# EAGLE design esp-stack-mini (EAGLE 7.3.0)
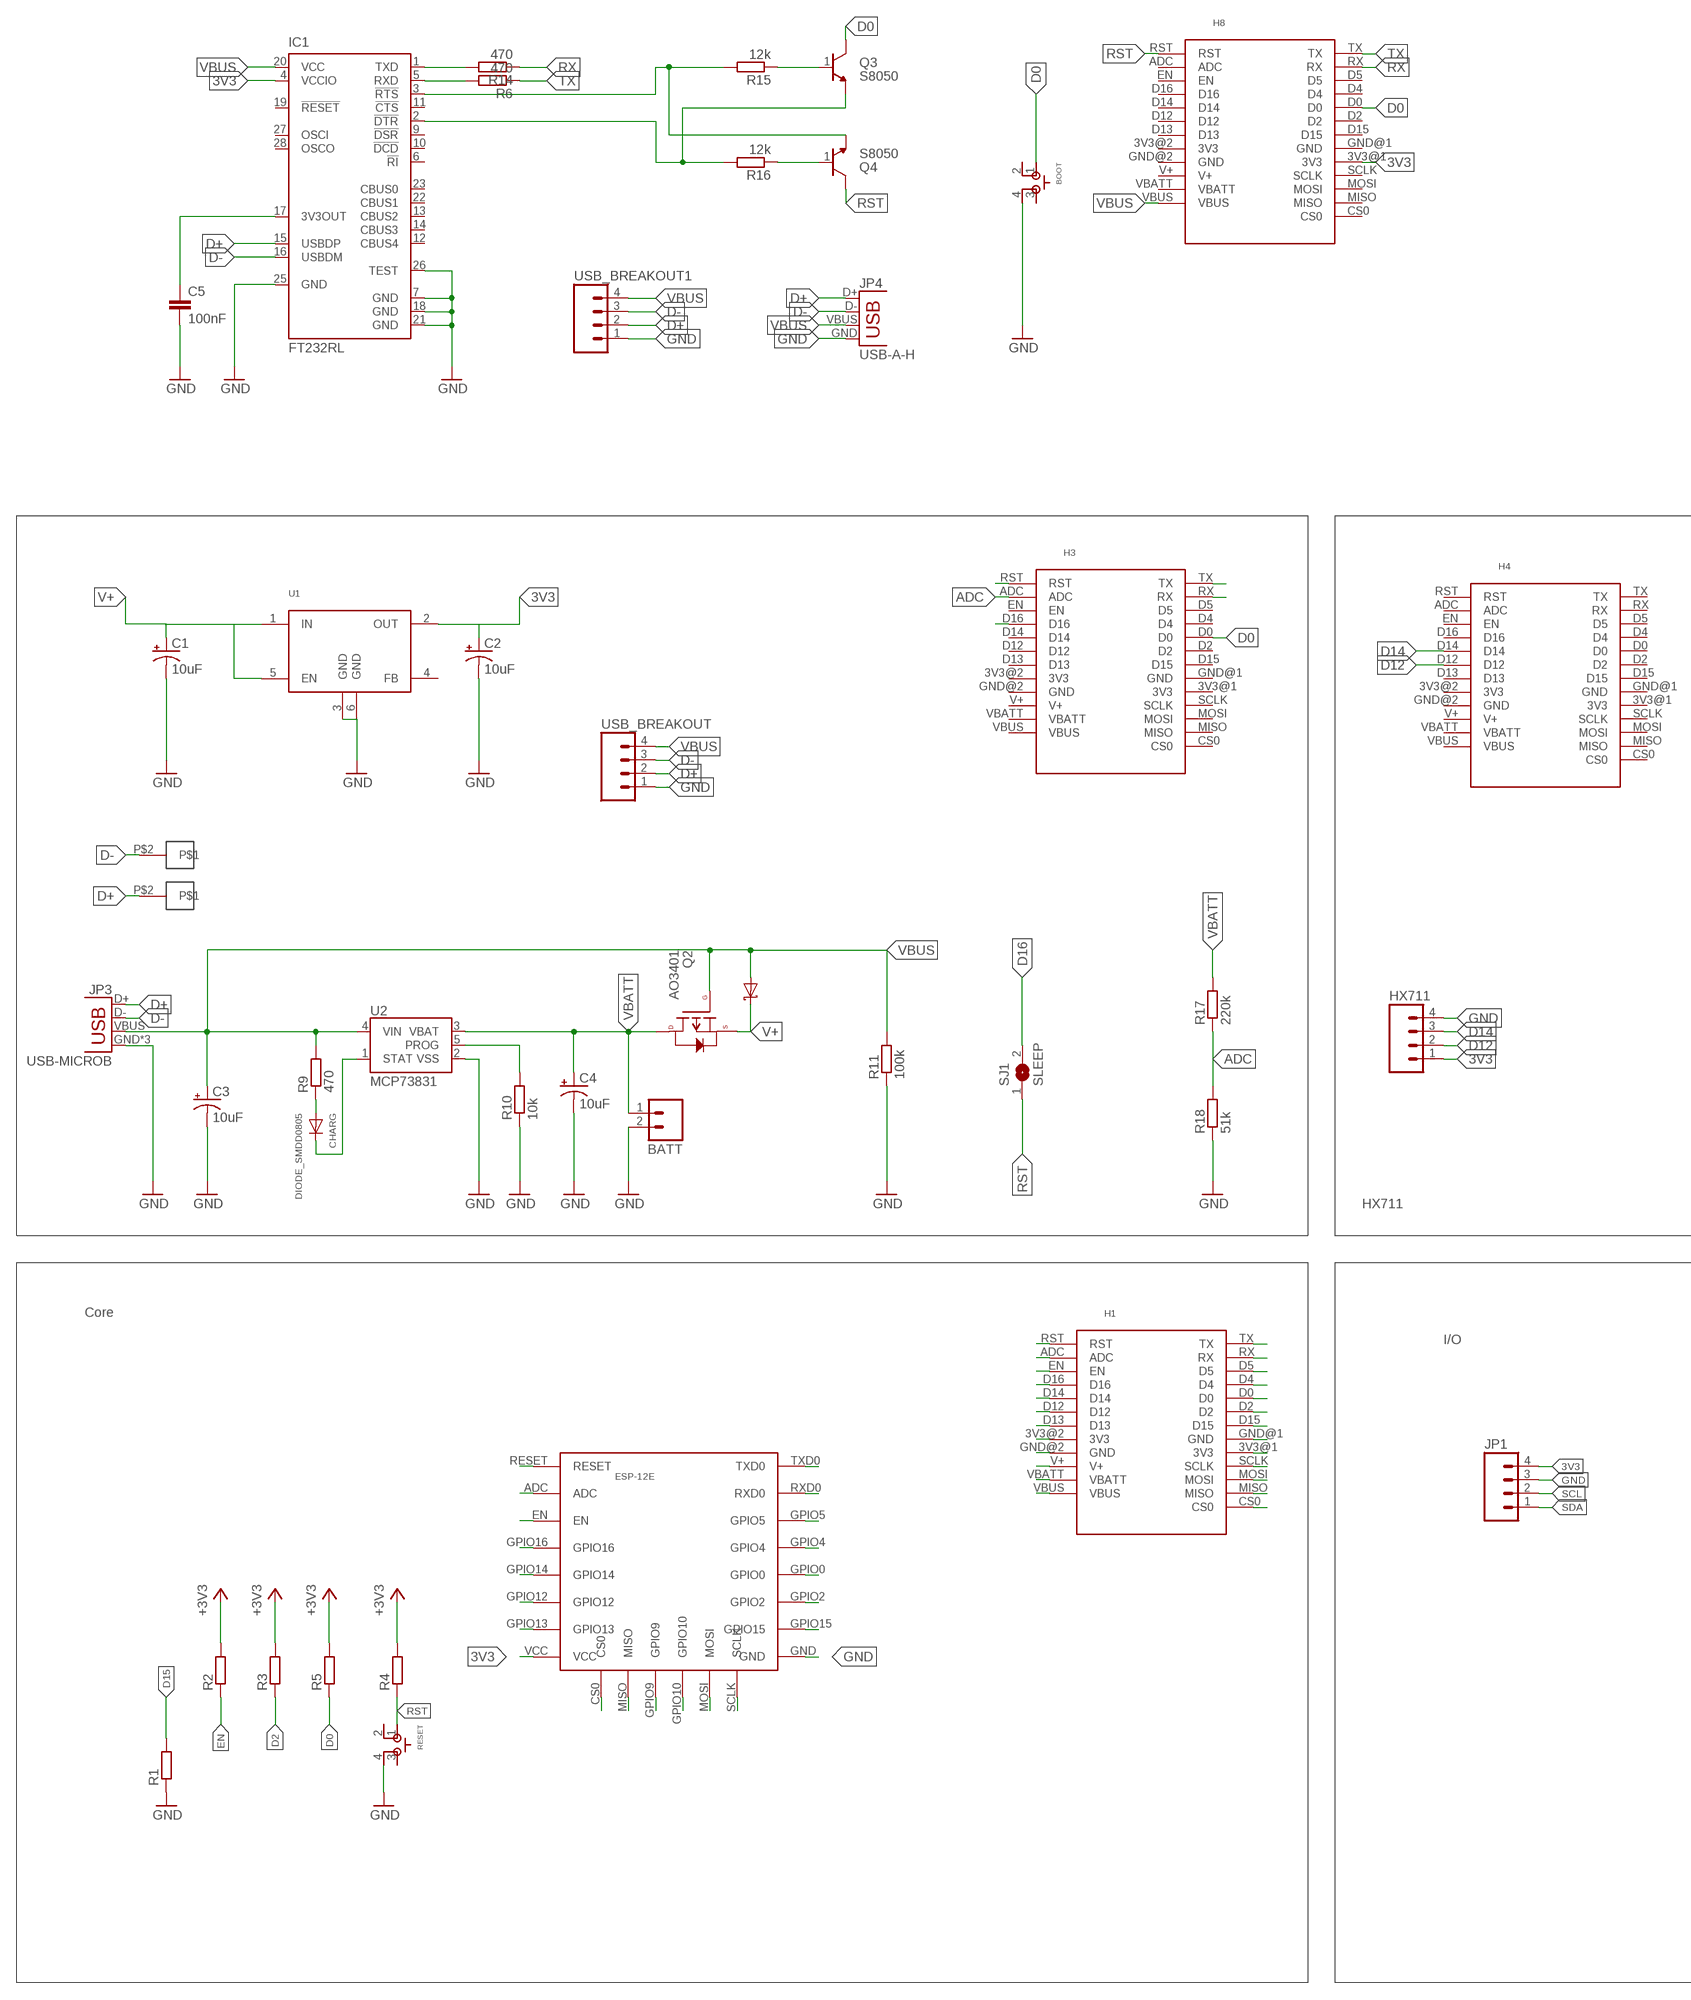
[diagram p0: schematic, sheet 1, part 1 of 2]
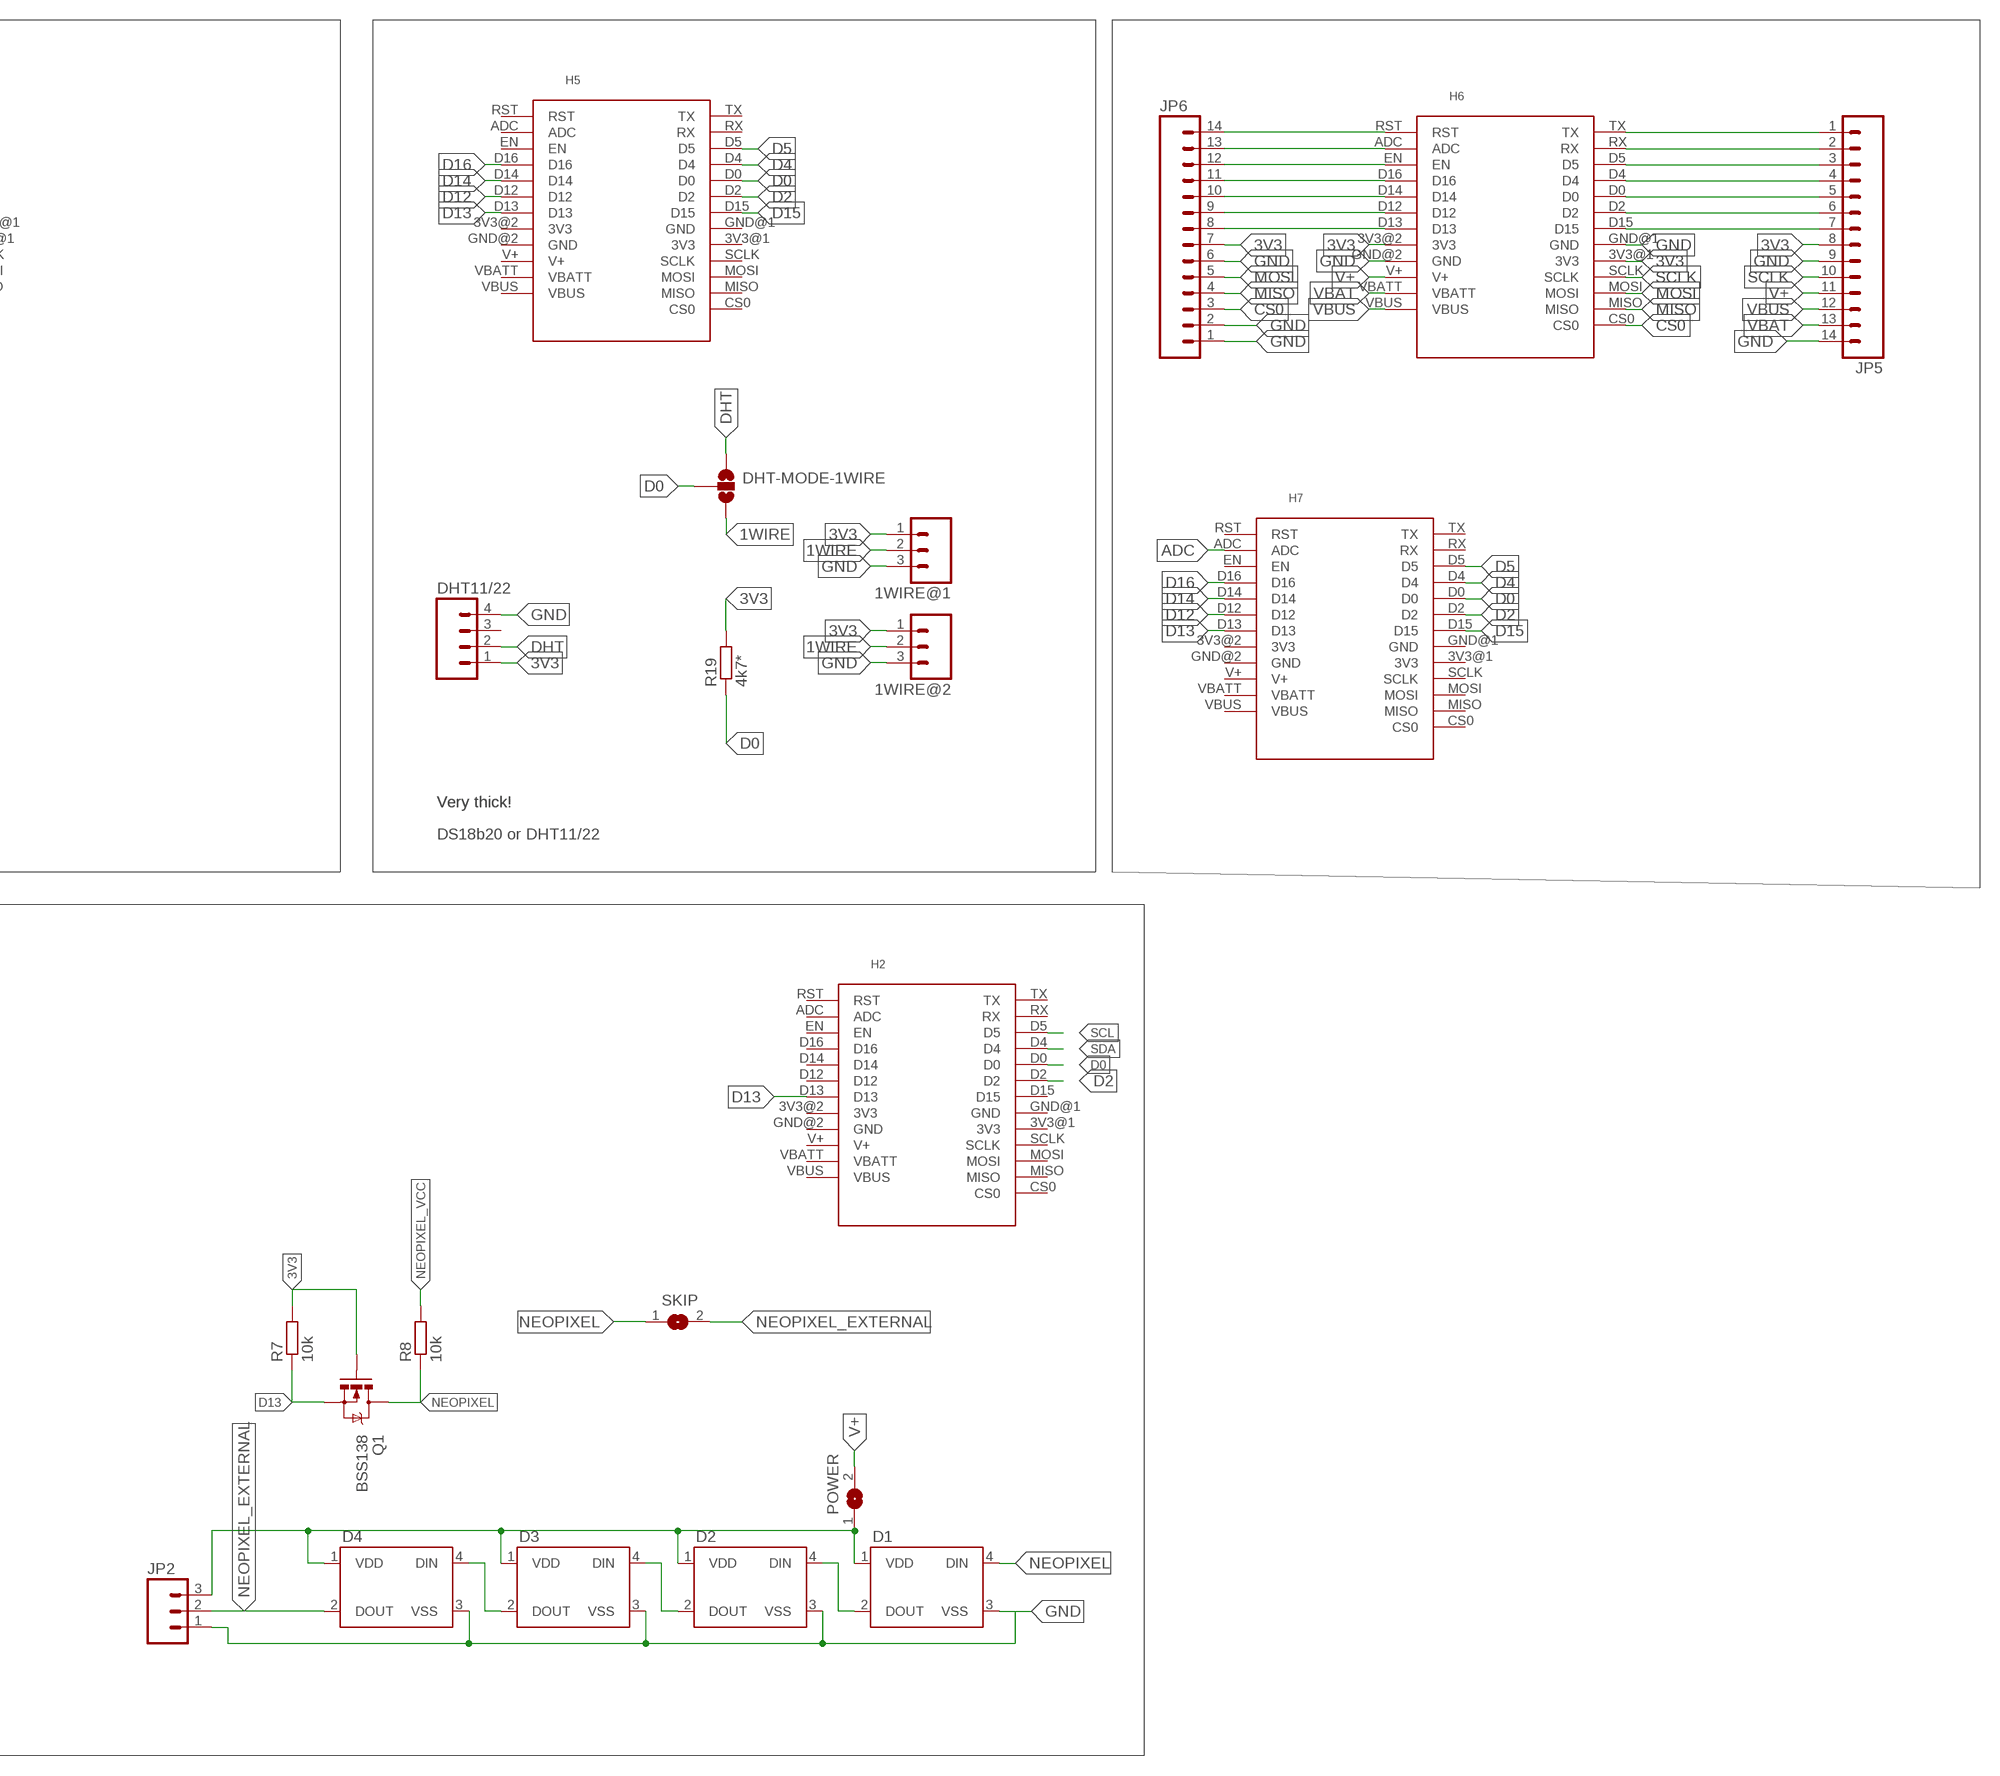
[diagram p1: schematic, sheet 1, part 2 of 2]

## Parts
1WIRE@1  M031X03_NO_SILK  [1X03_NO_SILK]
1WIRE@2  M031X03_NO_SILK  [1X03_NO_SILK]
BATT  M021X02_NO_SILK  [1X02_NO_SILK]
BOOT  SKSCLDE010  [SKSCLDE010]
C1  10uF  10UF-16V-10%(TANT)  [EIA3216]
C2  10uF  10UF-16V-10%(TANT)  [EIA3216]
C3  10uF  10UF-16V-10%(TANT)  [EIA3216]
C4  10uF  10UF-16V-10%(TANT)  [EIA3216]
C5  100nF  CAP0805  [0805]
CHARG  DIODE_SMDD0805  [D0805]
D1  WS2812B  [WS2812B]
D2  WS2812B  [WS2812B]
D3  WS2812B  [WS2812B]
D4  WS2812B  [WS2812B]
D5  MBR120  SCHOTTKY_DIODE_SMDSOD123  [SOD123]
DHT11/22  M04NO_SILK_ALL_ROUND  [1X04_NO_SILK_ALL_ROUND]
DHT-MODE-1WIRE  SOLDERJUMPER_2WAYT  [SJ_2]
ESP-12E  ESP-12E  [ESP-12E]
H1  ESP-BOARD  [ESP-BOARD]
H2  ESP-BOARD  [ESP-BOARD]
H3  ESP-BOARD  [ESP-BOARD]
H4  ESP-BOARD  [ESP-BOARD]
H5  ESP-BOARD  [ESP-BOARD]
H6  ESP-BOARD  [ESP-BOARD]
H7  ESP-BOARD  [ESP-BOARD]
H8  ESP-BOARD  [ESP-BOARD]
HX711  M04NO_SILK_ALL_ROUND  [1X04_NO_SILK_ALL_ROUND]
IC1  FT232RL  [SSOP28]
JP1  M04NO_SILK_ALL_ROUND  [1X04_NO_SILK_ALL_ROUND]
JP2  M031X03_NO_SILK  [1X03_NO_SILK]
JP3  USB-MICROB  [USB-MICROB]
JP4  USB-A-H  [USB-A-H]
JP5  M14  [1X14]
JP6  M14  [1X14]
POWER  SJ  [SJ]
Q1  BSS138  MOSFET-NCHANNELBSS138  [SOT23-3]
Q2  AO3401  P-CHANNEL-MOSFET  [SOT23-3]
Q3  S8050  NPN-TRANSISTOR  [SOT23-3]
Q4  S8050  NPN-TRANSISTOR  [SOT23-3]
R1  R-EU_R0805  [R0805]
R2  R-EU_R0805  [R0805]
R3  R-EU_R0805  [R0805]
R4  R-EU_R0805  [R0805]
R5  R-EU_R0805  [R0805]
R6  470  R-EU_R0805  [R0805]
R7  10k  R-EU_R0805  [R0805]
R8  10k  R-EU_R0805  [R0805]
R9  470  R-EU_R0805  [R0805]
R10  10k  R-EU_R0805  [R0805]
R11  100k  R-EU_R0805  [R0805]
R14  470  R-EU_R0805  [R0805]
R15  12k  R-EU_R0805  [R0805]
R16  12k  R-EU_R0805  [R0805]
R17  220k  R-EU_R0805  [R0805]
R18  51k  R-EU_R0805  [R0805]
R19  4k7*  R-EU_R0805  [R0805]
RESET  SKSCLDE010  [SKSCLDE010]
SJ1  SLEEP  SJ  [SJ]
SKIP  SJ  [SJ]
U1  TPS737XX  [SOT223-6]
U2  MCP73831  [SOT23-5]
U$2  POGO-PAD  [POGO-PAD]
U$3  POGO-PAD  [POGO-PAD]
USB_BREAKOUT  M04NO_SILK_ALL_ROUND  [1X04_NO_SILK_ALL_ROUND]
USB_BREAKOUT1  M04NO_SILK_ALL_ROUND  [1X04_NO_SILK_ALL_ROUND]

## Nets
1WIRE: 1WIRE@1.2 1WIRE@2.2 DHT-MODE-1WIRE.3
3V3: 1WIRE@1.1 1WIRE@2.1 C2.A(+) DHT11/22.1 ESP-12E.VCC H1.3V3@1(3V3) H1.3V3@2(3V3) H6.3V3@1(3V3) H6.3V3@2(3V3) H8.3V3@1(3V3) HX711.1 IC1.4(VCCIO) JP1.4 JP5.8 JP6.7 Q1.1(G) R2.2 R3.2 R4.2 R5.2 R7.2 R19.2 U1.2(OUT) ; supply symbol labelled +3V3
ADC: ESP-12E.ADC H1.ADC H3.ADC H7.ADC R17.1 R18.2
CS0: ESP-12E.CS0 H1.CS0 H6.CS0 JP6.3
D0: BOOT.1 DHT-MODE-1WIRE.2 ESP-12E.GPIO0 H1.D0 H2.D0 H3.D0 H5.D0 H7.D0 H8.D0 Q3.3 R5.1 R19.1
D2: ESP-12E.GPIO2 H1.D2 H2.D2 H5.D2 H7.D2 R3.1
D4: ESP-12E.GPIO4 H1.D4 H5.D4 H7.D4
D5: ESP-12E.GPIO5 H1.D5 H5.D5 H7.D5
D9: ESP-12E.GPIO9
D10: ESP-12E.GPIO10
D12: ESP-12E.GPIO12 H1.D12 H4.D12 H5.D12 H7.D12 HX711.2
D13: ESP-12E.GPIO13 H1.D13 H2.D13 H5.D13 H7.D13 Q1.2(S) R7.1
D14: ESP-12E.GPIO14 H1.D14 H4.D14 H5.D14 H7.D14 HX711.3
D15: ESP-12E.GPIO15 H1.D15 H5.D15 H7.D15 R1.2
D16: ESP-12E.GPIO16 H1.D16 H3.D16 H5.D16 H7.D16 SJ1.2
D+: IC1.15(USBDP) JP3.D+ JP4.D+ U$3.P$2 USB_BREAKOUT1.2 USB_BREAKOUT.2
D-: IC1.16(USBDM) JP3.D- JP4.D- U$2.P$2 USB_BREAKOUT1.3 USB_BREAKOUT.3
DHT: DHT11/22.2 DHT-MODE-1WIRE.1
EN: ESP-12E.EN H1.EN R2.1
GND: 1WIRE@1.3 1WIRE@2.3 BATT.2 BOOT.4 C1.C(-) C2.C(-) C3.C(-) C4.C(-) C5.2 D1.3(VSS) D2.3(VSS) D3.3(VSS) D4.3(VSS) DHT11/22.4 ESP-12E.GND H1.GND@1(GND) H1.GND@2(GND) H6.GND@1(GND) H6.GND@2(GND) HX711.4 IC1.7(GND) IC1.18(GND) IC1.21(GND) IC1.25(GND) IC1.26(TEST) JP1.3 JP2.1 JP3.GND JP3.MT1(GND) JP3.MT2(GND) JP4.GND JP5.9 JP5.14 JP6.1 JP6.2 JP6.6 R1.1 R10.1 R11.1 R18.1 RESET.4 U1.3(GND) U1.6(GND) U2.2(VSS) USB_BREAKOUT1.1 USB_BREAKOUT.1
MISO: ESP-12E.MISO H1.MISO H6.MISO JP6.4
MOSI: ESP-12E.MOSI H1.MOSI H6.MOSI JP6.5
N$1: D1.2(DOUT) D2.4(DIN)
N$2: D2.2(DOUT) D3.4(DIN)
N$3: D3.2(DOUT) D4.4(DIN)
N$4: IC1.5(RXD) R6.2
N$5: R10.2 U2.5(PROG)
N$6: CHARG.A R9.1
N$7: CHARG.K U2.1(STAT)
N$8: Q4.1 R16.1
N$9: Q3.1 R15.1
N$10: C5.1 IC1.17(3V3OUT)
N$13: IC1.1(TXD) R14.2
N$15: IC1.3(!RTS) Q4.2 R15.2
N$16: IC1.2(!DTR) Q3.2 R16.2
N$17: H6.TX JP5.1
N$18: H6.RX JP5.2
N$19: H6.D5 JP5.3
N$20: H6.D4 JP5.4
N$40: H6.D0 JP5.5
N$52: H6.D2 JP5.6
N$58: H6.D15 JP5.7
N$65: H6.RST JP6.14
N$66: H6.ADC JP6.13
N$67: H6.EN JP6.12
N$68: H6.D16 JP6.11
N$69: H6.D14 JP6.10
N$70: H6.D12 JP6.9
N$71: H6.D13 JP6.8
NEOPIXEL: D1.4(DIN) Q1.3(D) R8.1 SKIP.1
NEOPIXEL_EXTERNAL: D4.2(DOUT) JP2.2 SKIP.2
NEOPIXEL_VCC: D1.1(VDD) D2.1(VDD) D3.1(VDD) D4.1(VDD) JP2.3 POWER.1 R8.2
RST: ESP-12E.RESET H1.RST H3.RST H8.RST Q4.3 R4.1 RESET.1 SJ1.1
RX: ESP-12E.RXD0 H1.RX H3.RX H8.RX R14.1
SCL: H2.D5 JP1.2
SCLK: ESP-12E.SCLK H1.SCLK H6.SCLK JP5.10
SDA: H2.D4 JP1.1
TX: ESP-12E.TXD0 H1.TX H3.TX H8.TX R6.1
V+: C1.A(+) D5.C H1.V+ H6.V+ JP5.11 POWER.2 Q2.2(S) U1.1(IN) U1.5(EN)
VBAT: H6.VBATT JP5.13
VBATT: BATT.1 C4.A(+) H1.VBATT Q2.3(D) R17.2 U2.3(VBAT)
VBUS: C3.A(+) D5.A H1.VBUS H6.VBUS H8.VBUS IC1.20(VCC) JP3.VBUS JP4.VBUS JP5.12 Q2.1(G) R9.2 R11.2 U2.4(VIN) USB_BREAKOUT1.4 USB_BREAKOUT.4
Unconnected: BOOT.2 BOOT.3 DHT11/22.3 H2.ADC H2.CS0 H2.D12 H2.D14 H2.D15 H2.D16 H2.EN H2.MISO H2.MOSI H2.RST H2.RX H2.SCLK H2.TX H3.CS0 H3.D2 H3.D4 H3.D5 H3.D12 H3.D13 H3.D14 H3.D15 H3.EN H3.MISO H3.MOSI H3.SCLK H4.ADC H4.CS0 H4.D0 H4.D2 H4.D4 H4.D5 H4.D13 H4.D15 H4.D16 H4.EN H4.MISO H4.MOSI H4.RST H4.RX H4.SCLK H4.TX H5.ADC H5.CS0 H5.EN H5.MISO H5.MOSI H5.RST H5.RX H5.SCLK H5.TX H7.CS0 H7.EN H7.MISO H7.MOSI H7.RST H7.RX H7.SCLK H7.TX H8.ADC H8.CS0 H8.D2 H8.D4 H8.D5 H8.D12 H8.D13 H8.D14 H8.D15 H8.D16 H8.EN H8.MISO H8.MOSI H8.SCLK IC1.6(!RI) IC1.9(!DSR) IC1.10(!DCD) IC1.11(!CTS) IC1.12(CBUS4) IC1.13(CBUS2) IC1.14(CBUS3) IC1.19(!RESET) IC1.22(CBUS1) IC1.23(CBUS0) IC1.27(OSCI) IC1.28(OSCO) RESET.2 RESET.3 U1.4(FB)

## Notes on the sheet
- Very thick! | Very thick!
- HX711 | DS18b20 or DHT11/22
- Core
- I/O

## Power pins joined to a net without a drawn wire
3V3: H2.3V3@1(3V3) H2.3V3@2(3V3) H3.3V3@1(3V3) H3.3V3@2(3V3) H4.3V3@1(3V3) H4.3V3@2(3V3) H5.3V3@1(3V3) H5.3V3@2(3V3) H7.3V3@1(3V3) H7.3V3@2(3V3) H8.3V3@2(3V3)
GND: H2.GND@1(GND) H2.GND@2(GND) H3.GND@1(GND) H3.GND@2(GND) H4.GND@1(GND) H4.GND@2(GND) H5.GND@1(GND) H5.GND@2(GND) H7.GND@1(GND) H7.GND@2(GND) H8.GND@1(GND) H8.GND@2(GND)
V+: H2.V+ H3.V+ H4.V+ H5.V+ H7.V+ H8.V+
VBATT: H2.VBATT H3.VBATT H4.VBATT H5.VBATT H7.VBATT H8.VBATT
VBUS: H2.VBUS H3.VBUS H4.VBUS H5.VBUS H7.VBUS

## Library data of the parts
1WIRE@1 1WIRE@2 JP2 = SparkFun-Connectors:M03: Header 3 Standard 3-pin 0.1" header. Use with straight break away headers (SKU : PRT-00116), right angle break away headers (PRT-00553), swiss pins (PRT-00743), machine pins (PRT-00117), and female headers (PRT-00115). Molex polarized connector foot print use with SKU : PRT-08232 with associated crimp pins and housings.
BATT = SparkFun-Connectors:M02: Standard 2-pin 0.1" header. Use with - straight break away headers ( PRT-00116) - right angle break away headers (PRT-00553) - swiss pins (PRT-00743) - machine pins (PRT-00117) - female headers (PRT-00115) Molex polarized connector foot print use with: PRT-08233 with associated crimp pins and housings. 2.54_SCREWTERM for use with PRT-10571. 3.5mm Screw Terminal footprints for PRT-08084 5mm Screw Terminal footprints for use with PRT-08432
BOOT RESET = ESPStack-mini:SKSCLDE010
C1-C4 = ESPStack-mini:10UF-16V-10%(TANT): CAP-00811 1206/EIA-3216 Tantalum capacitor; PROD_ID: CAP-00811
C5 = SparkFun-Capacitors:CAP: Capacitor Standard 0603 ceramic capacitor, and 0.1" leaded capacitor.
CHARG = diodes_gen:DIODE_SMD: General Purpose Diode Library Unspecified diode types but packages D0805 doplnit D0605 D1206 SMA SMB SMC SOD123 SOD323 Diodes in 0603 package Typ Farnell number Link Notes TS4148RZG 8150192 Link <http://cz.farnell.com/taiwan-semiconductor/ts4148-rzg/diode-0-35a-603/dp/8150192> 1N41448 alt CD0603-S01xxx 7599754 Link <http://cz.farnell.com/bourns/cd0603-s0180r/switching-diode-90v-100ma-0603/dp/7599754> 1N41448 alt Diodes in 0805 package Typ Farnell number Link Notes TS4148RY 8150206 Link <http://cz.farnell.com/taiwan-semiconductor/ts4148-ry/diode-0-5a-0805-100v/dp/8150206> 1n4148 alt Diodes in 1202 package Typ Farnell number Link Notes TS4148RX 8150214 Link <http://cz.farnell.com/taiwan-semiconductor/ts4148-rx/diode-small-signal-100v-0-15a-1206/dp/8150214> CD1206-S01575 7599821 Link <http://cz.farnell.com/bourns/cd1206-s01575/switching-diode-100v-150ma-1206/dp/7599821> Diodes in SOD123 package Typ Farnell number Link Notes Link Diodes in SOD323 package Typ Farnell number Link Notes Link Diodes in SMA package Typ Farnell number Link Notes Link Diodes in SMB package Typ Farnell number Link Notes Link Diodes in SMC package Typ Farnell number Link Notes Link
D1-D4 = SparkFun-LED:WS2812B: WS2812B - Intelligent control LED integrated light source Technical Specifications: Power Supply Voltage (VDD): 3.5 to 5.3 V Input Voltage (VI): -0.5 to VDD+0.5 V Operating Junction Temperature (Topt): -25°C to +80°C Storage Temperature Range (Tstg): -55°C to +150°C; PROD_ID: DIO-12503
D5 = ESPStack-mini:SCHOTTKY_DIODE_SMD: Schottky Diode Library Unspecified diode types but packages D0805 doplnit D0605 SMA SMB SMC SOD123 SOD323
DHT11/22 HX711 JP1 USB_BREAKOUT USB_BREAKOUT1 = SparkFun-Connectors:M04: Header 4 Standard 4-pin 0.1" header. Use with straight break away headers (SKU : PRT-00116), right angle break away headers (PRT-00553), swiss pins (PRT-00743), machine pins (PRT-00117), and female headers (PRT-00115). Molex polarized connector foot print use with SKU : PRT-08231 with associated crimp pins and housings. 1MM SMD Version SKU: PRT-10208
DHT-MODE-1WIRE = SparkFun-Retired:SOLDERJUMPER_2WAY: Solder Jumper 2 way solder jumper
ESP-12E = ESPStack-mini:ESP-12E
H1-H8 = ESPStack-mini:ESP-BOARD: STANDARIZED ESP-STACK BOARD
IC1 = ftdichip:FT232R: Source: http://www.ftdichip.com/Documents/DataSheets/DS_FT232R_v104.pdf; MPN: FT232RL; OC_FARNELL: 1146032; OC_NEWARK: 91K9918
JP3 = SparkFun-Connectors:USB: USB Connectors USB-B-PTH is fully proven SKU : PRT-00139/CONN-08278 USB-miniB is fully proven SKU : PRT-00587 USB-A-PCB is untested. USB-A-H is throughly reviewed, but untested. Spark Fun Electronics SKU : PRT-00437 USB-B-SMT is throughly reviewed, but untested. Needs silkscreen touching up. USB-A-S has not been used/tested USB-MB-H has not been used/tested USB-MICROB has been used. CONN-09505; PROD_ID: CONN-09505
JP4 = SparkFun-Connectors:USB: USB Connectors USB-B-PTH is fully proven SKU : PRT-00139/CONN-08278 USB-miniB is fully proven SKU : PRT-00587 USB-A-PCB is untested. USB-A-H is throughly reviewed, but untested. Spark Fun Electronics SKU : PRT-00437 USB-B-SMT is throughly reviewed, but untested. Needs silkscreen touching up. USB-A-S has not been used/tested USB-MB-H has not been used/tested USB-MICROB has been used. CONN-09505; PROD_ID: CONN-08367
JP5 JP6 = SparkFun-Connectors:M14: Header 14 Standard 14-pin 0.1" header. Use with straight break away headers (SKU : PRT-00116), right angle break away headers (PRT-00553), swiss pins (PRT-00743), machine pins (PRT-00117), and female headers (PRT-00115).
POWER SJ1 SKIP = jumper:SJ: SMD solder JUMPER
Q1 = SparkFun-DiscreteSemi:MOSFET-NCHANNEL: Common NMOSFET Parts MFG P/N Store ID Prod ID FDD8780 TRANS-09984 SI7820DN TRANS-11055 FDS6630A IC-08089 2N7002PW TRANS-11151 FQP30N06L COM-10213 TRANS-10060 BSS123LT1G TRANS-08345 BSS138 TRANS-00830 BS170 2N7000; PROD_ID: TRANS-00830; VALUE: 200mA/50V
Q2 = ESPStack-mini:P-CHANNEL-MOSFET: P-Channel MOSFET Mode Field Effect Transistor
Q3 Q4 = ESPStack-mini:NPN-TRANSISTOR
R1-R11 R14-R19 = resistor:R-EU_: RESISTOR, European symbol
U1 = ESPStack-mini:TPS737XX
U2 = SparkFun-PowerIC:MCP73831: Miniature single cell, fully integrated Li-Ion, Li-polymer charge management controller http://ww1.microchip.com/downloads/en/DeviceDoc/20001984g.pdf IC-09995; PROD_ID: IC-09995
U$2 U$3 = ESPStack-mini:POGO-PAD

## Board
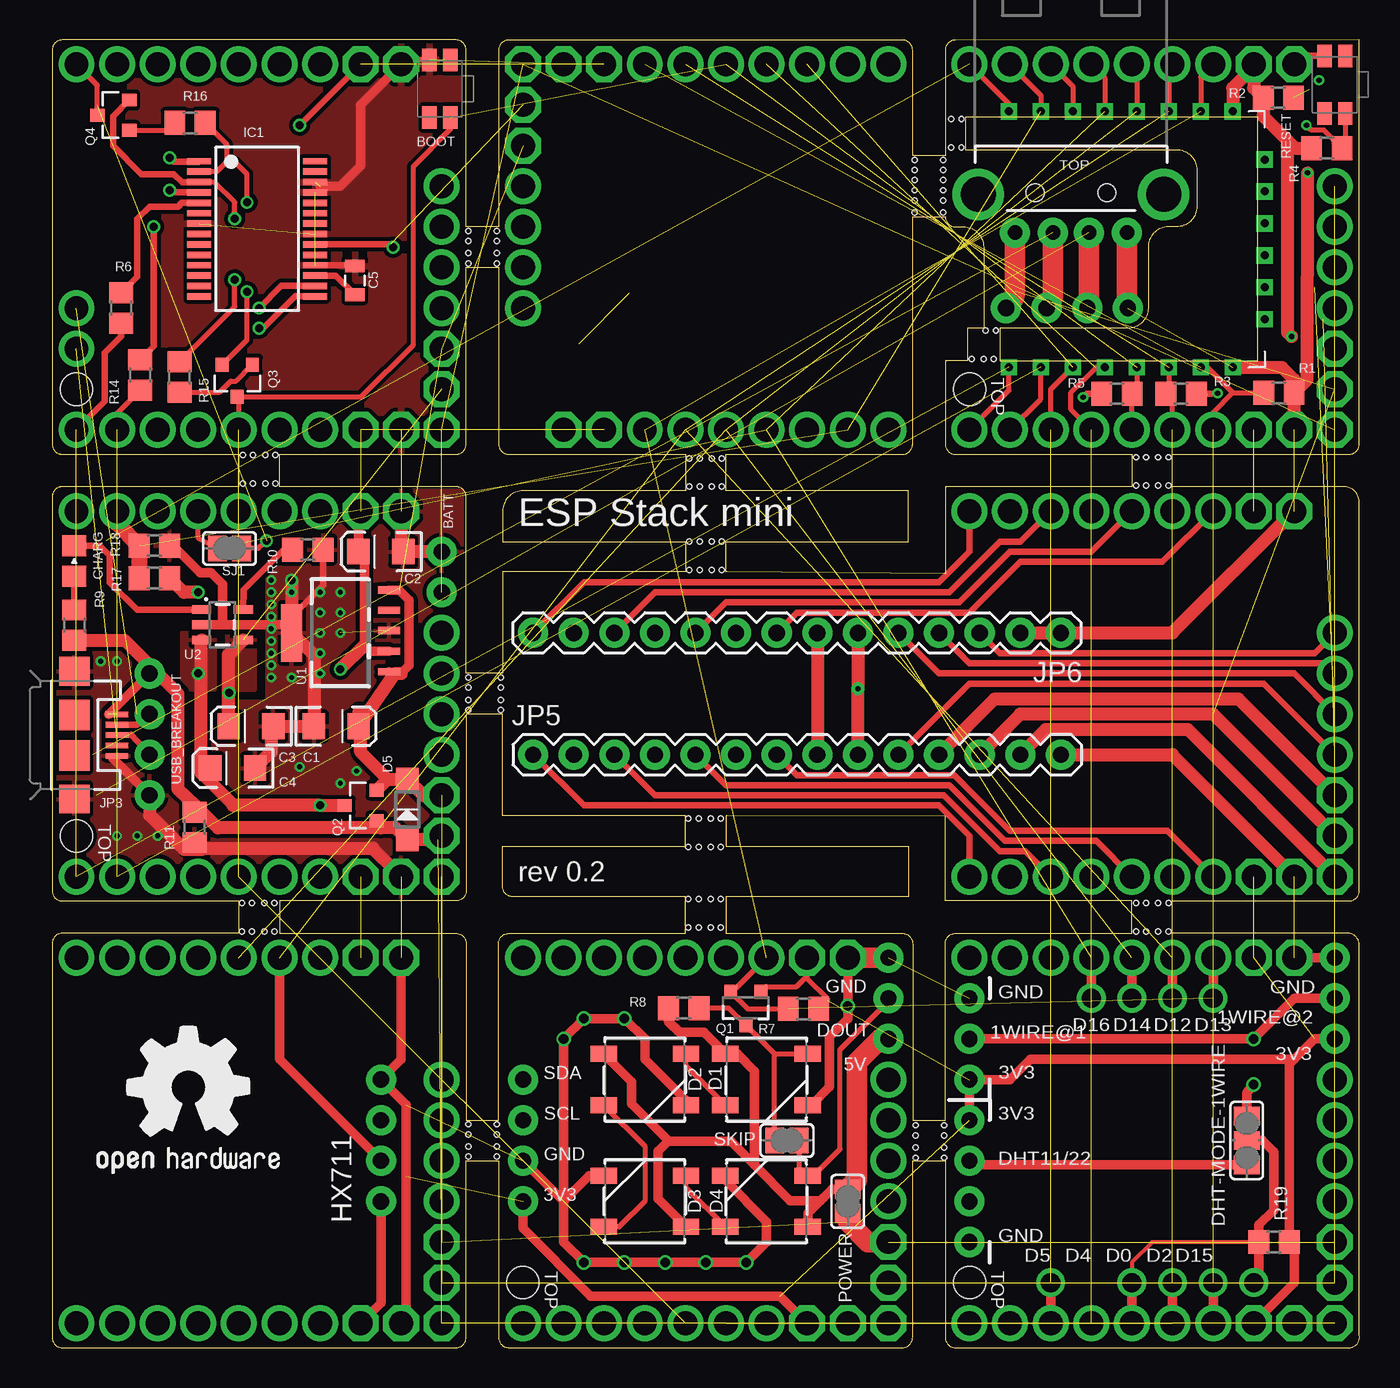
[diagram p2: board, top side]
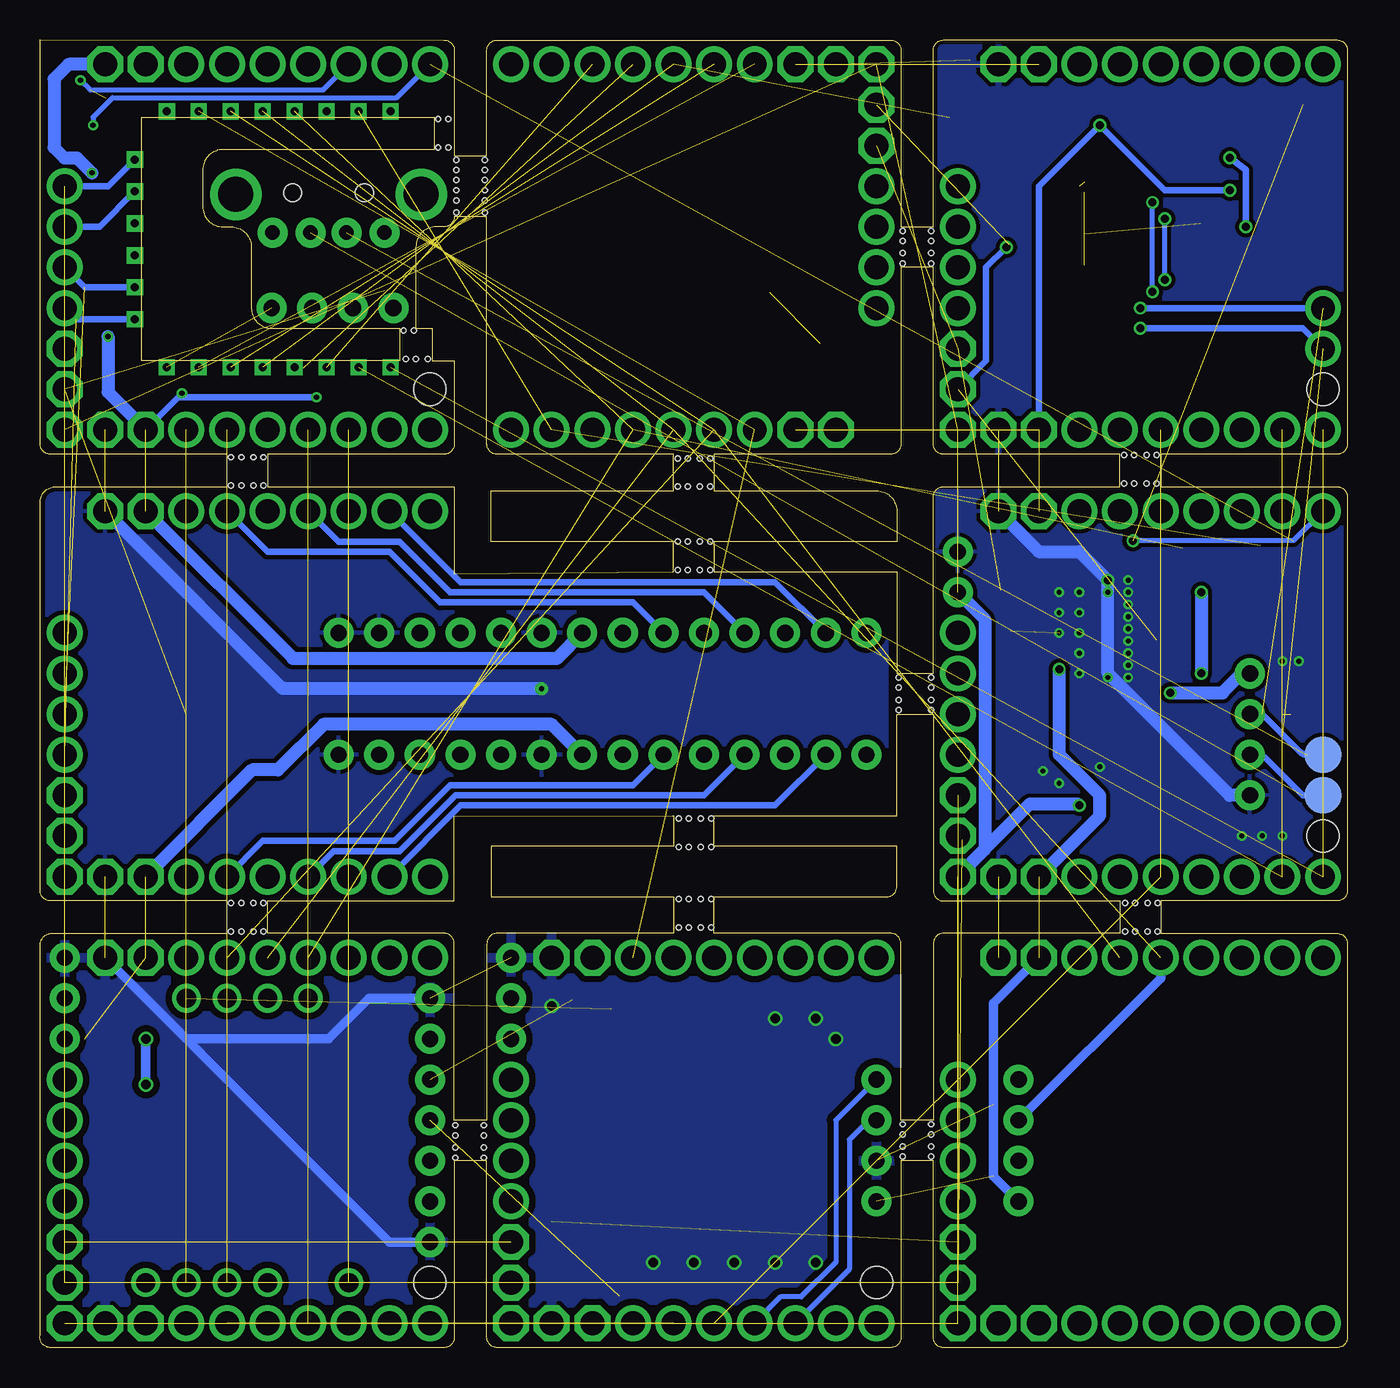
[diagram p3: board, bottom side, seen from below]

Size 81.81 x 81.79 mm. Coordinates in mm from the lower left corner, seen from the top.
Outline: 81.79,81.79 81.79,56.52 arc-90 81.15,55.88 70.1,55.88 70.1,53.85 80.87,53.85 arc-90 81.79,52.83 81.79,28.58 arc-90 81.15,27.94 70.1,27.94 70.1,25.91 81.15,25.91 arc-90 81.79,25.1 81.79,0.81 arc-105 81.15,0 56.52,0 arc-90 55.88,0.64 55.88,11.68 53.85,11.68 53.85,0.64 arc-90 53.21,0 28.58,0 arc-90 27.94,0.64 27.94,11.68 25.91,11.68 25.91,0.64 arc-90 25.27,0 0.64,0 arc-90 0,0.64 0,25.27 arc-90 0.64,25.91 11.68,25.91 11.68,27.94 0.64,27.94 arc-90 0,28.58 0,53.21 arc-90 0.64,53.85 11.68,53.85 11.68,55.88 0.64,55.88 arc-90 0,56.52 0,81.16 arc-90 0.64,81.79 25.27,81.79 arc-90 25.91,81.16 25.91,70.1 27.94,70.1 27.94,81.15 arc-90 28.58,81.79 53.21,81.79 arc-90 53.85,81.15 53.85,74.55 55.88,74.55 55.88,81.15 arc-90 56.52,81.79 81.79,81.79
Outline: 81.79,81.79 81.79,81.79
Outline: 27.94,25.27 arc-90 28.58,25.91
Copper layers (1*16): Top 0.035mm / dielectric 1.5mm / Bottom 0.035mm
Design rules "dirt_cheap_dirty_boards.v1": minimum track width 5mil, minimum drill 12mil, track to track 5mil, track to pad 5mil, pad to pad 5mil, via to via 5mil, smd to smd 0mil, copper to edge 10mil, drill to drill 10mil, minimum pad ring 10mil, minimum via ring 6mil, stop-mask expansion 2mil, vias tented up to drill 25mil, thermal gap 10mil
Holes 0.3 mm at 26.04,40.51 26.04,41.27 26.04,41.91 53.97,74.3 53.97,73.66 53.97,70.99 27.81,69.85 27.81,69.22 27.81,68.45 59.05,63.63 56.9,75.06 56.26,75.06 56.26,76.84 56.9,76.84 57.53,61.85 58.29,61.85 58.93,61.85 58.42,63.63 53.97,73.03 53.97,72.39 53.97,71.76 55.75,74.3 55.75,73.66 55.75,70.99 55.75,73.03 55.75,72.39 55.75,71.76 27.81,67.82 26.04,69.85 26.04,69.22 26.04,68.45 26.04,67.82 26.04,39.88 28.07,40.51 28.07,41.27 28.07,41.91 28.07,39.88 39.88,55.63 40.51,55.63 41.27,55.63 41.91,55.63 39.88,53.85 40.51,53.85 41.27,53.85 41.91,53.85 11.94,55.82 12.57,55.82 13.33,55.82 13.97,55.82 11.94,54.04 12.57,54.04 13.33,54.04 13.97,54.04 39.81,28.07 40.45,28.07 41.21,28.07 41.85,28.07 39.81,26.29 40.45,26.29 41.21,26.29 41.85,26.29 67.82,55.69 68.45,55.69 69.22,55.69 69.85,55.69 67.82,53.91 68.45,53.91 69.22,53.91 69.85,53.91 39.88,50.42 40.51,50.42 41.27,50.42 41.91,50.42 39.88,48.64 40.51,48.64 41.27,48.64 41.91,48.64 11.87,27.81 12.51,27.81 13.27,27.81 13.91,27.81 11.87,26.04 12.51,26.04 13.27,26.04 13.91,26.04 39.81,33.08 40.45,33.08 41.21,33.08 41.85,33.08 39.81,31.31 40.45,31.31 41.21,31.31 41.85,31.31 54.04,11.87 54.04,12.51 54.04,13.27 54.04,13.91 55.82,11.87 55.82,12.51 55.82,13.27 55.82,13.91 67.82,27.81 68.45,27.81 69.22,27.81 69.85,27.81 67.82,26.04 68.45,26.04 69.22,26.04 69.85,26.04 26.04,11.94 26.04,12.57 26.04,13.33 26.04,13.97 27.81,11.94 27.81,12.57 27.81,13.33 27.81,13.97
Holes 2 mm at 57.4,59.94 29.46,4.06 57.4,4.06 1.52,32 1.52,59.94
Milling: 95 lines

### Footprints (pad centres in the part's own frame; a part is rotated, then mirrored left to right if it is on the bottom)
1X03_NO_SILK = drill 1.016 pad 1.88: 1 0,0; 2 2.54,0; 3 5.08,0
1X02_NO_SILK = drill 1.016 pad 1.88: 1 0,0; 2 2.54,0
SKSCLDE010 = smd 1.4 x 0.9: 1 -1.8,-0.65; 2 1.8,-0.65; 3 -1.8,0.65; 4 1.8,0.65
EIA3216 = smd 1.4 x 1.6: A 1.4,0; C -1.4,0
0805 = smd 0.8 x 1.2: 1 -0.9,0; 2 0.9,0
D0805 = smd 1.3 x 1.5: A -0.95,0; K 0.95,0
WS2812B = smd 1.651 x 1: 1 -2.577,1.6; 2 -2.577,-1.6; 3 2.577,-1.6; 4 2.577,1.6
SOD123 = smd 1.4 x 1.4: A 1.9,0; C -1.9,0
1X04_NO_SILK_ALL_ROUND = drill 1.016 pad 1.88: 1 0,0; 2 2.54,0; 3 5.08,0; 4 7.62,0
SJ_2 = smd 1.168 x 1.6: 1 -1.524,0; 2 0,0; 3 1.524,0
ESP-12E = drill 0.5 pad 1 square: ADC 16.002,14.004; CS0 12.997,0.002; EN 16.002,12.004; GND 0,2.002; GPIO0 0,8.002; GPIO2 0,6.002; GPIO4 0,10.002; GPIO5 0,12.002; GPIO9 8.997,0.002; GPIO10 6.997,0.002; GPIO12 16.002,6.004; GPIO13 16.002,4.004; GPIO14 16.002,8.004; GPIO15 0,4.002; GPIO16 16.002,10.004; MISO 10.997,0.002; MOSI 4.997,0.002; RESET 16.004,16.006; RXD0 0,14.002; SCLK 2.997,0.002; TXD0 0,16.002; VCC 16.002,2.004
ESP-BOARD = drill 1.5 pad 1.93 octagon: 3V3@1 19.05,1.27; 3V3@2 19.05,24.13; GND@1 21.59,1.27; GND@2 21.59,24.13; V+ 24.13,6.35; VBATT 24.13,1.27; VBUS 24.13,3.81 | drill 1.5 pad 1.93: ADC 3.81,24.13; CS0 24.13,16.51; D0 11.43,1.27; D2 13.97,1.27; D4 8.89,1.27; D5 6.35,1.27; D12 13.97,24.13; D13 16.51,24.13; D14 11.43,24.13; D15 16.51,1.27; D16 8.89,24.13; EN 6.35,24.13; MISO 24.13,13.97; MOSI 24.13,11.43; RST 1.27,24.13; RX 3.81,1.27; SCLK 24.13,8.89; TX 1.27,1.27
SSOP28 = smd 0.4 x 1.5: 1 -4.225,-3.625; 2 -3.575,-3.625; 3 -2.925,-3.625; 4 -2.275,-3.625; 5 -1.625,-3.625; 6 -0.975,-3.625; 7 -0.325,-3.625; 8 0.325,-3.625; 9 0.975,-3.625; 10 1.625,-3.625; 11 2.275,-3.625; 12 2.925,-3.625; 13 3.575,-3.625; 14 4.225,-3.625; 15 4.225,3.625; 16 3.575,3.625; 17 2.925,3.625; 18 2.275,3.625; 19 1.625,3.625; 20 0.975,3.625; 21 0.325,3.625; 22 -0.325,3.625; 23 -0.975,3.625; 24 -1.625,3.625; 25 -2.275,3.625; 26 -2.925,3.625; 27 -3.575,3.625; 28 -4.225,3.625
USB-MICROB = smd 0.35 x 1.4: D+ 0,2.65; D- -0.65,2.65; GND 1.3,2.65; ID 0.65,2.65; VBUS -1.3,2.65 | smd 1.8 x 1.9: MT1 -4,0; MT2 4,0 | smd 1.9 x 1.9: P$1 -1.27,0; P$2 1.27,0
USB-A-H = drill 0.914 pad 1.88: D+ 2.4,1.127; D- 2.4,-1.127; GND 2.4,3.5; VBUS 2.4,-3.5 | drill 2.2: GND2 0,-5.8; GND3 0,5.8 | hole 1.1: -0.1,2.25; -0.1,-2.25
1X14 = drill 1.016 pad 1.88: 1 0,0; 2 2.54,0; 3 5.08,0; 4 7.62,0; 5 10.16,0; 6 12.7,0; 7 15.24,0; 8 17.78,0; 9 20.32,0; 10 22.86,0; 11 25.4,0; 12 27.94,0; 13 30.48,0; 14 33.02,0
SJ = smd 1.168 x 1.6: 1 -0.762,0; 2 0.762,0
SOT23-3 = smd 0.8 x 0.9: 1 -0.95,-1; 2 0.95,-1; 3 0,1.1
SOT23-3' = smd 0.8 x 0.9: 1 -0.95,-1; 2 0.95,-1; 3 0,1
R0805 = smd 1.3 x 1.5: 1 -0.95,0; 2 0.95,0
SOT223-6 = smd 0.457 x 1.397: 1 -2.427,-4.32; 2 -1.143,-4.32; 3 0.141,-4.32; 4 1.411,-4.32; 5 2.681,-4.32 | smd 3.6 x 1.3: 6 0,1.78
SOT23-5 = smd 0.55 x 1.2: 1 -0.95,-1.3; 2 0,-1.3; 3 0.95,-1.3; 4 0.95,1.3; 5 -0.95,1.3
POGO-PAD = smd 2.286 x 2.286: P$2 0,0

### Placement (x,y rotation side)
1WIRE@1  57.4,16.76 90 top
1WIRE@2  80.26,19.3 90 bottom
BATT  24.38,47.24 90 top
BOOT  24.26,78.74 90 top
C1  17.78,38.86 0 top
C2  20.57,49.78 180 top
C3  12.45,38.86 180 top
C4  11.3,36.25 180 top
C5  18.95,66.75 90 top
CHARG  1.4,49.2 90 top
D1  44.7,16.76 0 top
D2  37.08,16.76 0 top
D3  37.08,9.14 180 top
D4  44.7,9.14 180 top
D5  22.23,33.66 270 top
DHT11/22  57.4,14.22 270 bottom
DHT-MODE-1WIRE  74.75,12.95 90 top
ESP-12E  75.87,61.32 90 top
H1  56.13,56.13 0 top
H2  28.19,0.25 0 top
H3  0.25,28.19 0 top
H4  0.25,0.25 0 top
H5  56.13,0.25 0 top
H6  56.13,28.19 0 top
H7  53.59,81.53 180 top
H8  0.25,56.13 0 top
HX711  20.57,9.14 90 top
IC1  12.83,69.98 270 top
JP1  29.46,16.76 270 top
JP2  52.32,24.38 270 top
JP3  1.4,38.31 270 top
JP4  63.75,72.14 270 top
JP5  30.1,37.08 0 top
JP6  63.12,44.7 180 top
POWER  49.78,9.14 270 top
Q1  43.41,21.26 180 top
Q2  AO3401  [SOT23-3']  19.3,33.91 90 top
Q3  S8050  [SOT23-3']  11.58,60.48 180 top
Q4  S8050  [SOT23-3']  3.84,77.09 90 top
R1  76.76,59.72 180 top
R2  76.73,78.18 180 top
R3  70.64,59.66 0 top
R4  79.76,75.03 180 top
R5  66.62,59.66 180 top
R6  4.32,65.02 90 top
R7  47.02,21.18 0 top
R8  39.52,21.23 180 top
R9  1.4,45.19 270 top
R10  16,49.91 180 top
R11  8.92,32.54 90 top
R14  5.51,60.83 90 top
R15  7.98,60.71 90 top
R16  8.64,76.61 0 top
R17  6.4,48.13 0 top
R18  6.4,50.16 180 top
R19  76.45,6.6 0 top
RESET  80.26,78.99 90 top
SJ1  11.1,49.99 180 top
SKIP  45.97,12.95 0 top
U1  16.76,44.7 90 top
U2  10.67,45.21 270 top
U$1  [OSHW1]  2.16,9.14 0 top
U$2  1.52,37.08 0 bottom
U$3  1.52,34.54 0 bottom
USB_BREAKOUT  6.1,34.54 90 top
USB_BREAKOUT1  67.31,65.02 180 top

### Tracks (layer width: path | path; a pad name or v marks a point on that pad's centre or on a via)
1WIRE  (via drill 0.6)
  Top 0.61: 1WIRE@1.2 v75.18,19.3 77.72,21.84 1WIRE@2.2 | DHT-MODE-1WIRE.3 74.75,15.93 v75.18,16.46
  Bottom 0.61: v75.18,16.46 v75.18,19.3
3V3  (via drill 0.33 pad 0.3, 0.5)  (10 unrouted)
  Top 0.305: Q1.1 44.68,22.58 46.58,22.58 47.24,23.24 H2.3V3@2 47.24,23.11 48.51,21.84 48.51,21.73 R7.2
  Top 0.406: R5.2 64.75,59.66 v64.52,59.44 | R3.2 72.54,59.66 v72.92,59.69 | v7.37,72.39 7.5,72.25 IC1.4 | H8.3V3@2 v15.49,76.45
  Top 0.61: JP1.4 29.46,7.47 33.71,3.23 45.54,3.23 H2.3V3@1 | 1WIRE@2.1 78.99,19.3 77.72,18.03 | DHT11/22.1 1WIRE@1.1 59.94,16.76 61.21,18.03 77.72,18.03 | H5.3V3@1 77.72,4.06 77.72,6.28 R19.2 77.4,17.71 77.72,18.03 | U1.2 19.94,43.56 19.56,43.94 19.56,49.4 C2.A 19.17,52.19 H3.3V3@2 | HX711.1 20.57,2.79 H4.3V3@1
  Top 0.813: H1.3V3@2 75.18,80.11 | 75.18,80.11 73.87,78.79 ESP-12E.VCC | 75.18,80.11 75.18,78.78 R2.2 75.78,77.02 77.29,75.51 | 77.29,75.51 77.29,63.5 v77.55,63.25 | 77.29,75.51 77.78,75.03 R4.2 | v18.03,42.42 19.56,43.94 | JP6.7 JP5.8
  Bottom 0.406: v64.52,59.44 73.15,59.44 | 73.15,59.44 H1.3V3@1 | v72.92,59.69 72.82,59.77 73.15,59.44 | v7.37,72.39 11.43,72.39 v15.49,76.45 19.3,72.64 H8.3V3@1
  Bottom 0.61: HX711.1 22.16,10.73 22.16,21.53 H4.3V3@2
  Bottom 0.813: v77.55,63.25 77.55,59.77 H1.3V3@1 | H3.3V3@1 15.49,33.27 15.49,34.54 18.03,37.08 v18.03,42.42 | JP5.8 49.78,38.99 64.07,38.99 66.93,36.13 68.52,36.13 H6.3V3@1 | H6.3V3@2 65.98,43.12 49.47,43.12 JP6.7
ADC  (2 unrouted)
  Top 0.305: H1.ADC 61.87,78.34 ESP-12E.ADC
  Top 1.016: H3.ADC 4.06,51.55 R18.2 R17.1
CS0  (1 unrouted)
  Top 0.406: H6.CS0 78.99,43.43 59.31,43.43 JP6.3
  Bottom 0.406: H1.CS0 77.54,72.64 ESP-12E.CS0
D0  (via drill 1.2)  (5 unrouted)
  Top 0.254: R19.1 68.83,6.6 67.56,5.33 v67.56,4.06
  Top 0.305: H1.D0 R5.1 67.87,59.96 ESP-12E.GPIO0 | H8.D0 11.68,59.38 Q3.3 19.35,59.48 22.61,62.74 22.61,73.88 24.89,76.2 24.91,76.2 BOOT.1
  Top 0.61: v67.56,4.06 H5.D0 | v75.18,4.06 75.5,4.38 R19.1 75.51,7.67 76.43,8.58 76.43,12.24 75.72,12.95 DHT-MODE-1WIRE.2
D2  (via drill 1.2)  (3 unrouted)
  Top 0.305: H1.D2 70.1,59.43 R3.1 69.87,59.77 ESP-12E.GPIO2
  Top 0.61: v70.1,4.06 H5.D2
D4  (2 unrouted)
  Top 0.305: H1.D4 63.75,58.67 63.75,59.74 65.3,61.29 65.84,61.29 ESP-12E.GPIO4
D5  (via drill 1.2)  (2 unrouted)
  Top 0.305: H1.D5 62.48,59.93 ESP-12E.GPIO5
  Top 0.61: v62.48,4.06 H5.D5
D12  (via drill 1.2)  (3 unrouted)
  Top 0.305: H1.D12 69.87,80.03 ESP-12E.GPIO12
  Top 0.61: H5.D12 v70.1,21.84 | H4.D12 14.22,18.03 HX711.2
D13  (via drill 1.2)  (3 unrouted)
  Top 0.305: H1.D13 71.87,79.49 ESP-12E.GPIO13 | H2.D13 42.58,22.26 Q1.2 43.53,21.18 R7.1
  Top 0.61: H5.D13 v72.64,21.84
D14  (via drill 1.2)  (3 unrouted)
  Top 0.305: H1.D14 67.87,79.96 ESP-12E.GPIO14
  Top 0.61: H5.D14 v67.56,21.84
  Bottom 0.61: HX711.3 11.68,23.11 H4.D14
D15  (via drill 1.2)  (2 unrouted)
  Top 0.305: ESP-12E.GPIO15 72.29,61.32 73.89,59.71 | 73.89,59.71 R1.2 | H1.D15 72.64,58.47 73.89,59.71
  Top 0.61: v72.64,4.06 H5.D15
D16  (via drill 1.2)  (3 unrouted)
  Top 0.305: H1.D16 65.87,79.42 ESP-12E.GPIO16 | SJ1.2 9.14,50.62 H3.D16
  Top 0.61: H5.D16 v65.02,21.84
D+  (via drill 0.5, 1.5)  (2 unrouted)
  Top 0.406: JP3.D+ 4.95,38.33 USB_BREAKOUT.2 | v12.95,63.75 13.21,63.75 15.21,65.75 IC1.15
  Top 1.27: JP4.D+ 64.88,65.29 arc-45 USB_BREAKOUT1.2
  Bottom 0.406: v1.52,62.48 2.79,63.75 v12.95,63.75 | USB_BREAKOUT.2 5.6,37.08 arc45 5.15,36.9 2.79,34.54 U$3.P$2
D-  (via drill 0.5, 1.5)  (2 unrouted)
  Top 0.406: JP3.D- 5.28,38.96 USB_BREAKOUT.3 | v12.95,65.02 14.33,66.4 IC1.16
  Top 1.27: JP4.D- 62.63,65.95 arc-45 62.25,65.05 USB_BREAKOUT1.3
  Bottom 0.406: v1.52,65.02 v12.95,65.02 | U$2.P$2 2.53,37.08 arc45 2.98,37.27 5.33,39.62 USB_BREAKOUT.3
DHT
  Top 0.61: DHT-MODE-1WIRE.1 57.66,11.43 DHT11/22.2
EN  (via drill 0.33 pad 0.3)  (1 unrouted)
  Top 0.305: H1.EN 63.87,78.88 ESP-12E.EN
  Bottom 0.305: H1.EN 64.08,78.66 78.66,78.66 v79.27,79.27
GND  (via drill 0.3, 0.3 pad 0.81, 0.33 pad 0.3, 0.5, 0.6)  (14 unrouted)
  Top 0.305: BOOT.4 22.37,80.54 H8.GND@2
  Top 0.406: R10.1 16.95,47.69 14.48,45.21 | IC1.18 18.9,67.7 C5.2 | R11.1 7.83,31.59 6.1,33.32 | 9.45,31.24 7.87,31.24 6.1,33.02 USB_BREAKOUT.1 | RESET.4 78.25,80.79 H1.GND@2
  Top 0.61: D2.3 39.66,15.46 37.08,18.03 37.08,19.3 v35.81,20.57 v33.27,20.57 v32,19.3 32,9.14 | D4.3 42.13,10.45 44.7,7.87 44.7,6.6 v43.43,5.33 v40.89,5.33 v38.35,5.33 v35.81,5.33 v33.27,5.33 32,6.6 32,9.14 | JP1.3 32,9.14 | D3.3 33.6,10.74 32,9.14 | D1.3 47.5,15.16 48.64,16.31 48.64,19.43 49.78,20.57 v49.78,21.36 H2.GND@2 | 1WIRE@2.3 H5.GND@2 | 3.79,36.85 USB_BREAKOUT.1 | U2.2 10.67,45.21 | 10.67,45.21 14.48,45.21 U1.6 | R18.1 7.57,50.16 9.27,48.46 9.96,48.46 10.67,47.75 10.67,45.21 | H8.GND@2 19.3,77.72 19.3,73.91 18.03,72.64 16.76,72.64 | H4.GND@2 21.84,18.03 HX711.4 22.16,15.18 22.16,1.84 H4.GND@1
  Top 0.813: H1.GND@1 77.72,59.7 R1.1 | R1.1 78.54,60.54 v78.56,73.48 | ESP-12E.GND 76.95,61.32 77.71,60.55 R1.1 | H3.GND@2 21.84,49.91 C2.C BATT.2 | 9.4,31.24 9.45,31.24 | 9.45,31.24 20.07,31.24 H3.GND@1 | C4.C 13.72,37.26 13.72,38.73 C3.C C1.C 16.38,43.31 U1.6 v14.99,48.01 | USB_BREAKOUT.1 6.1,33.32 8.25,31.17 9.37,31.17 9.45,31.24 | JP6.2 JP6.1 70.1,44.7 H6.GND@2 | JP5.14 70.1,37.08 H6.GND@1 | JP5.9 v50.42,41.21 JP6.6
  Top 1.27: JP2.1 H2.GND@2 | JP4.GND 67.25,65.16 arc45 USB_BREAKOUT1.1
  Bottom 0.61: DHT11/22.4 59.94,6.6 72.64,19.3 | 72.64,19.3 H5.GND@2 | 1WIRE@1.3 61.21,21.84 63.75,19.3 72.64,19.3
  Bottom 0.813: H1.GND@2 80.01,80.26 80.92,79.35 80.92,75.06 80.29,74.42 79.5,74.42 v78.56,73.48 | H3.GND@2 19.3,49.78 16.76,49.78 v14.99,48.01 14.99,42.16 7.37,34.54 USB_BREAKOUT.1 | v50.42,41.21 66.61,41.21 H6.GND@2
  other vias: 18.03,44.7 18.03,45.97 16.76,44.7 16.76,45.97 16.76,47.24 18.03,47.24 13.72,47.24 13.72,48.01 13.72,46.48 13.72,45.72 13.72,44.96 13.72,44.2 13.72,43.43 13.72,42.67 13.72,41.91 14.99,41.91 14.99,47.24 16.76,43.43 16.76,42.16 3.05,42.93 4.06,42.93 4.06,32 5.33,32 6.6,32 18.03,35.31 19.05,36.07 15.49,36.32
  pour Bottom (isolate 0.406): 56.13,25.65 81.53,25.65 81.53,0.25 56.13,0.25
  pour Bottom (isolate 0.406): 28.19,25.65 53.59,25.65 53.59,0.25 28.19,0.25
  pour Top (isolate 0.254): 0.25,81.53 0.25,56.13 25.65,56.13 25.65,81.53
  pour Bottom (isolate 0.254): 0.25,81.53 0.25,56.13 25.65,56.13 25.65,81.53
  pour Top (isolate 0.254): 0.25,53.59 0.25,28.19 25.65,28.19 25.65,53.59 13.46,53.59 13.46,40.39 7.37,40.39 7.37,53.59
  pour Bottom (isolate 0.254): 0.25,53.59 0.25,28.19 25.65,28.19 25.65,53.59
  pour Bottom (isolate 0.305): 28.83,48.2 28.83,33.59 56.13,33.59 56.13,28.19 81.53,28.19 81.53,53.59 56.13,53.59 56.13,48.2
MISO  (1 unrouted)
  Top 0.406: JP6.4 57.4,42.8 79.63,42.8 H6.MISO
  Bottom 0.406: H1.MISO 78.08,70.1 ESP-12E.MISO
MOSI  (1 unrouted)
  Top 0.406: JP6.5 55.5,42.16 77.72,42.16 H6.MOSI
  Bottom 0.406: ESP-12E.MOSI 79.01,66.31 H1.MOSI
N$1
  Top 0.305: D1.2 39.66,17.63 D2.4
N$2
  Top 0.305: D2.2 37.08,12.59 37.08,9.14 35.48,7.54 D3.4
N$3
  Top 0.305: D4.4 39.66,10.01 D3.2
N$4
  Top 0.406: R6.2 5.33,66.99 5.33,70.61 6.1,71.37 7.87,71.37 8.1,71.6 IC1.5
N$5
  Top 0.406: U2.5 11.97,47.41 14.4,49.81 14.99,49.84 R10.2
N$6
  Top 0.406: CHARG.A R9.1
N$7
  Top 0.406: U2.1 5.33,46.16 3.61,47.85 3.61,49.52 2.97,50.15 CHARG.K
N$8
  Top 0.305: Q4.1 7.22,76.14 R16.1
N$9
  Top 0.305: R15.1 10.48,59.76 11.18,60.45 11.51,60.45 Q3.1
N$10
  Top 0.406: IC1.17 17.75,67.05 C5.1
N$13  (via drill 0.5)
  Top 0.406: R14.2 6.35,62.62 v6.35,70.1 | v7.37,74.42 7.62,74.17 9.17,74.17 IC1.1
  Bottom 0.406: v6.35,70.1 6.35,73.66 v7.37,74.42
N$15  (via drill 0.5)
  Top 0.305: R15.2 11.43,65.11 v11.43,66.8 | IC1.3 10.16,72.9 11.43,71.63 v11.43,70.61
  Top 0.406: IC1.3 8.12,72.9 7.62,73.41 5.59,73.41 3.81,75.18 3.81,77.01 Q4.2
  Bottom 0.305: v11.43,66.8 v11.43,70.61
N$16  (via drill 0.5)
  Top 0.305: R16.2 10.92,75.27 10.92,74.17 | 10.92,74.17 10.31,73.55 IC1.2 | Q3.2 12.19,63.04 v12.19,66.04 | 10.92,74.17 11.43,74.17 12.19,73.41 v12.19,71.63
  Bottom 0.305: v12.19,66.04 v12.19,71.63
N$17
  Top 0.406: JP5.1 33.27,33.91 55.5,33.91 57.4,32 H6.TX
N$18
  Bottom 0.406: JP5.2 35.81,33.91 55.5,33.91 H6.RX
N$19
  Top 0.406: JP5.3 37.72,34.54 55.82,34.54 57.72,32.64 59.31,31.05 60.9,31.05 H6.D5
N$20
  Bottom 0.406: JP5.4 40.26,34.54 55.82,34.54 57.72,32.64 59.31,31.05 63.44,31.05 H6.D4
N$38  (1 unrouted)
N$40
  Top 0.406: JP5.5 42.16,35.18 56.13,35.18 58.67,32.64 59.63,31.69 65.34,31.69 H6.D0
N$52
  Bottom 0.406: JP5.6 44.7,35.18 56.13,35.18 58.67,32.64 59.63,31.69 67.88,31.69 H6.D2
N$58
  Top 0.406: JP5.7 46.61,35.81 56.45,35.81 59.94,32.32 69.79,32.32 H6.D15
N$65
  Top 0.406: JP6.14 33.27,47.88 55.5,47.88 57.4,49.78 H6.RST
N$66
  Bottom 0.406: JP6.13 35.81,47.88 55.5,47.88 H6.ADC
N$67
  Top 0.406: JP6.12 37.72,47.24 56.13,47.24 59.31,50.42 60.58,50.42 H6.EN
N$68
  Bottom 0.406: JP6.11 40.26,47.24 56.13,47.24 59.31,50.42 63.12,50.42 H6.D16
N$69
  Top 0.406: JP6.10 42.16,46.61 56.77,46.61 59.94,49.78 65.02,49.78 H6.D14
N$70
  Bottom 0.406: JP6.9 44.7,46.61 56.77,46.61 59.94,49.78 67.56,49.78 H6.D12
N$71
  Top 0.406: JP6.8 46.61,45.97 57.4,45.97 60.58,49.15 69.47,49.15 H6.D13
NEOPIXEL
  Top 0.305: 45.2,18.36 43.85,19.72 Q1.3 42.33,21.23 R8.1 | 45.2,18.36 D1.4 | SKIP.1 45.21,18.36 45.2,18.36
NEOPIXEL_EXTERNAL
  Top 0.305: JP2.2 52.32,21.67 49.3,18.64 49.3,12.42 47.62,10.74 D4.2 46.74,11.29 SKIP.2
NEOPIXEL_VCC
  Top 0.61: POWER.1 48.79,9.91 48.27,9.38 48.08,9.2 | 48.08,9.2 46.18,9.2 43.94,11.43 | 43.94,11.43 42.47,12.9 38.61,12.9 | 38.61,12.9 36.25,15.26 36.25,16.62 D2.1 | 38.61,12.9 38.53,12.9 37.9,12.27 37.9,9.31 D3.1 | 43.94,11.43 43.94,17.3 42.88,18.36 D1.1 40.78,19.71 39.24,19.71 38.57,20.38 R8.2 | D4.1 47.28,8.39 48.08,9.2
  Top 1.27: JP2.3 51.82,19.3 50.37,17.86 50.37,10.49 POWER.1
RST  (via drill 0.33 pad 0.3, 0.5)  (2 unrouted)
  Top 0.305: H1.RST 59.86,77.8 ESP-12E.RESET | v78.49,76.45 78.79,76.15 79.59,76.15 R4.1 80.91,75.24 RESET.1 | v13.41,50.47 12.9,49.99 SJ1.1 | Q4.3 2.83,78.95 H8.RST 2.79,78.99 2.79,77.72
  Bottom 0.305: H1.RST 59.49,78.18 77.27,78.18 78.49,76.96 v78.49,76.45 | H3.RST 3.38,50.47 v13.41,50.47
RX  (2 unrouted)
  Top 0.305: H1.RX 61.87,59.33 ESP-12E.RXD0 | R14.1 4.06,58.43 H8.RX
SCL
  Bottom 0.305: JP1.2 29.95,14.22 31.17,13 31.17,4.9 H2.D5
SCLK  (1 unrouted)
  Top 0.406: H6.SCLK 75.82,41.53 57.4,41.53 JP5.10
  Bottom 0.406: ESP-12E.SCLK 79.55,64.31 H1.SCLK
SDA
  Bottom 0.305: JP1.1 32,14.22 32,5.33 34.19,3.17 35.46,3.17 H2.D4
TX  (2 unrouted)
  Top 0.305: H1.TX 59.87,59.87 ESP-12E.TXD0
  Top 0.406: R6.1 4.32,63.25 3.3,62.23 3.3,59.18 H8.TX
V+  (7 unrouted)
  Top 0.61: U1.5 21.7,47.38 22.35,46.74 22.35,42.67 21.84,42.16 21.2,42.16 U1.1
  Top 0.813: H3.V+ 23.24,34.54 D5.C 21,35.55 | Q2.2 21,35.55 | 21,35.55 19.3,37.25 19.3,39.62 19.18,39.75 C1.A 21.47,42.16 21.84,42.16 | JP5.11 58.99,40.58 74.23,40.58 H6.V+
  Top 1.27: POWER.2 49.78,7.87 51.05,6.6 H2.V+
VBAT
  Top 0.813: JP5.13 62.17,38.67 71.06,38.67 H6.VBATT
VBATT  (via drill 0.5)  (6 unrouted)
  Top 0.305: C4.A 9.47,35.81 9.32,35.94
  Top 0.813: 9.32,35.94 9.32,42.16 | 9.32,42.16 9.32,44.22 U2.3 | v9.14,42.16 9.32,42.16 | v9.14,47.24 8.24,47.24 R17.2 | 9.47,35.81 11.33,33.96 11.33,33.91 v16.76,33.91 Q2.3
  Bottom 0.813: v9.14,47.24 v9.14,42.16 | BATT.1 22.68,45.54 22.68,31.19 | H3.VBATT 22.68,31.17 22.68,31.19 | 22.68,31.19 19.86,34.01 16.87,34.01 v16.76,33.91
  pour Top (isolate 0.305): 10.16,44.7 10.16,41.15 8.13,41.15 8.13,44.7
VBUS  (via drill 0.5)  (9 unrouted)
  Top 0.406: v21.34,68.83 21.17,69 IC1.20
  Top 0.61: 3.54,39.61 USB_BREAKOUT.4
  Top 0.813: 22.47,32 D5.A | H3.VBUS 24.14,31.76 D5.A | D5.A 21.47,32.51 20.57,32.51 | 20.57,32.51 10.36,32.51 8.91,33.96 | 8.91,33.96 7.87,34.92 7.87,40.89 6.6,42.16 | 6.6,42.16 USB_BREAKOUT.4 | Q2.1 20.57,32.69 20.57,32.51 | U2.4 11.05,43.34 C3.A 11.05,40.92 v11.07,40.95 | R11.2 8.91,33.96 | R9.2 4.53,44.24 6.6,42.16 | H6.VBUS 72.64,39.62 60.58,39.62 JP5.12
  Top 1.27: JP4.VBUS 60.25,66.11 arc-45 59.88,65.22 USB_BREAKOUT1.4
  Bottom 0.406: H8.VBUS 22.61,61.72 22.61,67.56 v21.34,68.83
  Bottom 0.813: v11.07,40.95 7.82,40.95 6.6,42.16 | 6.6,42.16 USB_BREAKOUT.4 5.71,42.54 6.22,42.54 6.6,42.16
  pour Top (isolate 0.305): 12.7,44.7 10.92,44.7 10.92,41.15 12.7,41.15

### Text on the board
tPlace: TOP | GND | GND | GND | DOUT | 3V3 | 5V | SDA | 3V3 | SCL | 3V3 | GND | 3V3 | GND
tNames: TOP | ESP Stack mini | TOP | rev 0.2 | D16 | D14 | D12 | D13 | TOP | TOP | D5 | D4 | D0 | D2 | D15